# Altium schematic sheet Universal Register 4Bit.SchDoc: Universal Register 4Bit
size A4; SheetNumber: 1; SheetTotal: 1; PartNumber: PNxxx; Drawn By: Sebastian Kulik; ProjectName: DVT SPI Buffer
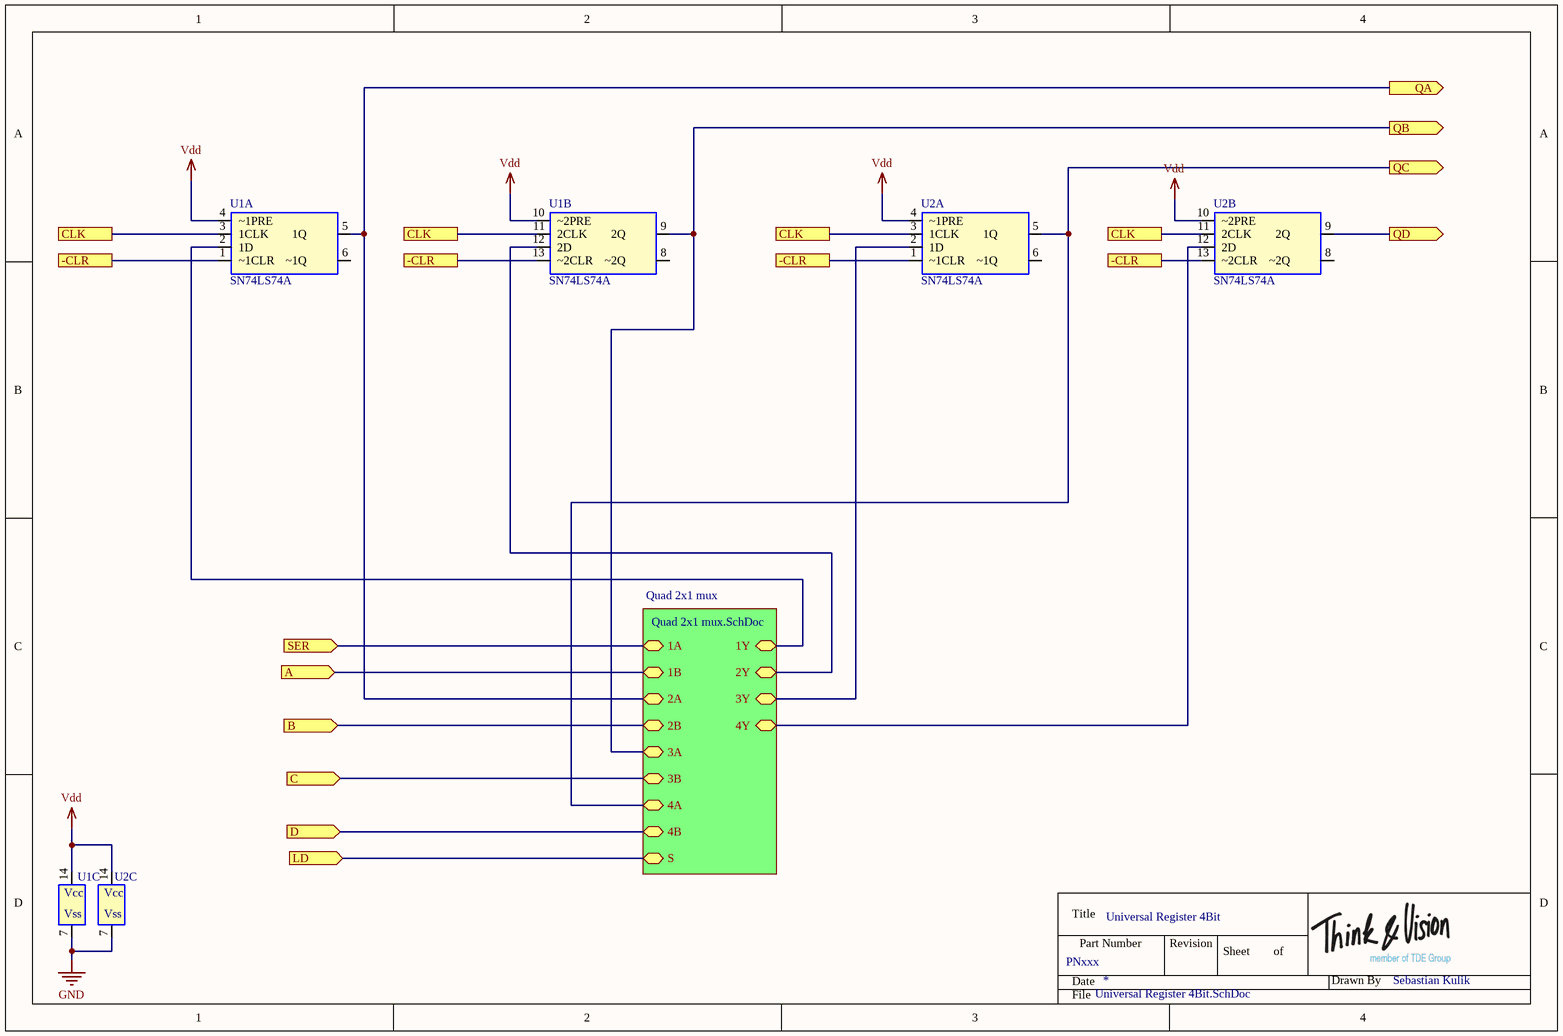
[diagram p0: Universal Register 4Bit.SchDoc]

## Parts
U1  SN74LS74A  [DIP-14]  (parts A,B,C of 3)
U2  SN74LS74A  [DIP-14]  (parts A,B,C of 3)

## Sub-sheets
Quad 2x1 mux = Quad 2x1 mux.SchDoc: 1A, 1B, 2A, 2B, 3A, 3B, 4A, 4B, S, 1Y, 2Y, 3Y, 4Y

## Ports
-CLR, A (in), B (in), C (in), CLK, D (in), LD (in), QA (out), QB (out), QC (out), QD (out), SER (in)

## Nets
GND: U1.7(Vss) U2.7(Vss)
Vdd: U1.4(~1PRE) U1.10(~2PRE) U1.14(Vcc) U2.4(~1PRE) U2.10(~2PRE) U2.14(Vcc)
-CLR: U1.1(~1CLR) U1.13(~2CLR) U2.1(~1CLR) U2.13(~2CLR) ; port -CLR
A: port A, sheet Quad 2x1 mux/1B
B: port B, sheet Quad 2x1 mux/2B
C: port C, sheet Quad 2x1 mux/3B
CLK: U1.3(1CLK) U1.11(2CLK) U2.3(1CLK) U2.11(2CLK) ; port CLK
D: port D, sheet Quad 2x1 mux/4B
LD: port LD, sheet Quad 2x1 mux/S
QA: U1.5(1Q) ; port QA, sheet Quad 2x1 mux/2A
QB: U1.9(2Q) ; port QB, sheet Quad 2x1 mux/3A
QC: U2.5(1Q) ; port QC, sheet Quad 2x1 mux/4A
QD: U2.9(2Q) ; port QD
SER: port SER, sheet Quad 2x1 mux/1A
NetU1_2: U1.2(1D) ; sheet Quad 2x1 mux/1Y
NetU1_12: U1.12(2D) ; sheet Quad 2x1 mux/2Y
NetU2_2: U2.2(1D) ; sheet Quad 2x1 mux/3Y
NetU2_12: U2.12(2D) ; sheet Quad 2x1 mux/4Y

Not connected (* = marked no-connect by the designer): U1 6(~1Q) 8(~2Q); U2 6(~1Q) 8(~2Q)

## Notes on the sheet
- Title
- Date
- Part Number
- Revision
- Sheet
- of
- Drawn By
- File

## Library data of the parts
U1 U2 = SN74LS74A: Flip-Flop Dual, TTL; Deliverer PartNr: 307-597; Manufacturer PartNr: SN74LS74AN; Manufacturer: TI; Deliverer: RS; TDE-PN: IC0089; Published: 24.11.2016; PackageDescription: DIP14; Publisher: Sebastian Kulik; Price: 0.48